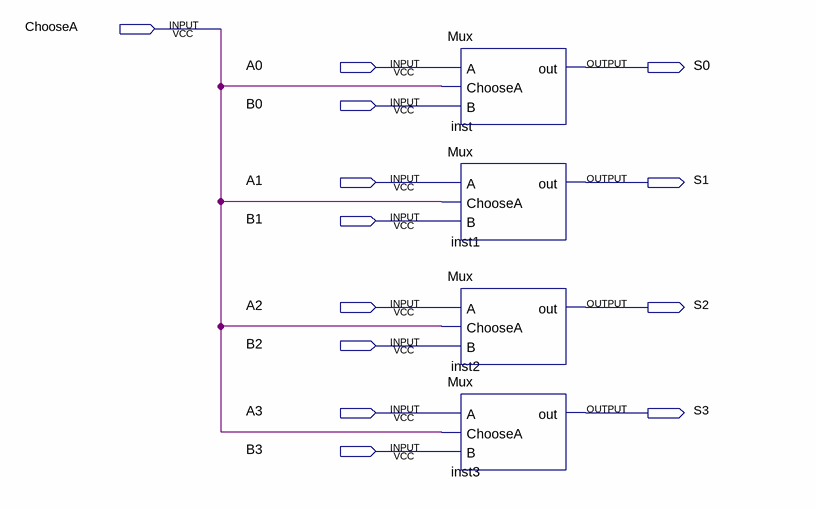
[diagram p0: schematic sheet]
// Quartus schematic Mux4bit.bdf as structural Verilog: 4 symbols, 13 pins
module Mux4bit (
  input  ChooseA,
  input  A0,
  input  B0,
  input  A1,
  input  B1,
  input  A2,
  input  B2,
  input  A3,
  input  B3,
  output S0,
  output S1,
  output S2,
  output S3
);

  Mux inst (.A(A0), .ChooseA(ChooseA), .B(B0), .out(S0));
  Mux inst1 (.A(A1), .ChooseA(ChooseA), .B(B1), .out(S1));
  Mux inst2 (.A(A2), .ChooseA(ChooseA), .B(B2), .out(S2));
  Mux inst3 (.A(A3), .ChooseA(ChooseA), .B(B3), .out(S3));
endmodule
